# EAGLE design prototipo_2_0 (EAGLE 6.1)
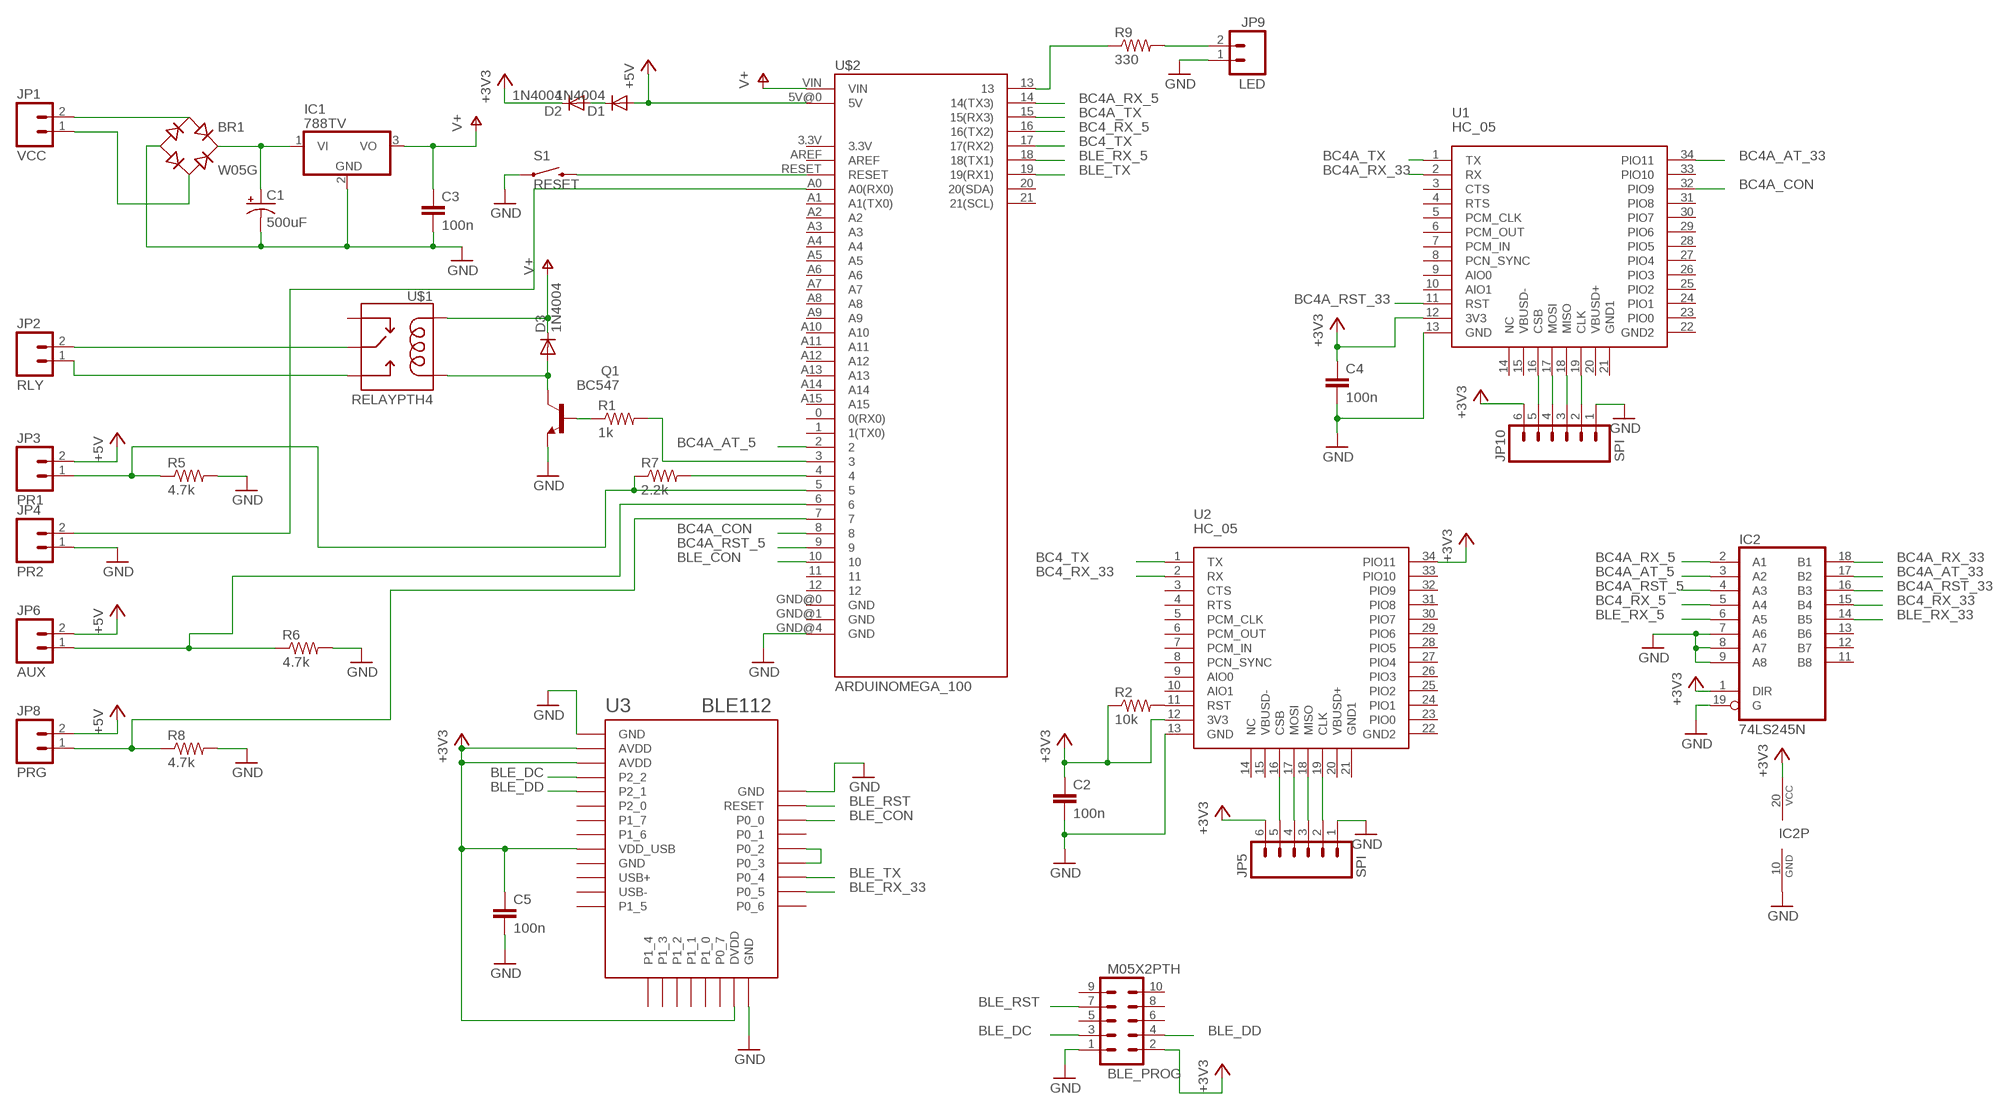
[diagram p0: schematic, sheet 1]

## Parts
BLE_PROG  M05X2PTH  [AVR_ICSP]
BR1  W05G  [WOG]
C1  500uF  CAP_POLPTH4  [CPOL-RADIAL-1000UF-25V]
C2  100n  C5/3  [C5B3]
C3  100n  C5/3  [C5B3]
C4  100n  C5/3  [C5B3]
C5  100n  C5/3  [C5B3]
D1  1N4004  [DO41-10]
D2  1N4004  [DO41-10]
D3  1N4004  [DO41-10]
IC1  788TV  [TO220V]
IC2  74LS245N  [DIL20]
JP1  VCC  M023.5MM  [SCREWTERMINAL-3.5MM-2]
JP2  RLY  M023.5MM  [SCREWTERMINAL-3.5MM-2]
JP3  PR1  M023.5MM  [SCREWTERMINAL-3.5MM-2]
JP4  PR2  M023.5MM  [SCREWTERMINAL-3.5MM-2]
JP5  SPI  M06SIP  [1X06]
JP6  AUX  M023.5MM  [SCREWTERMINAL-3.5MM-2]
JP8  PRG  M023.5MM  [SCREWTERMINAL-3.5MM-2]
JP9  LED  M023.5MM  [SCREWTERMINAL-3.5MM-2]
JP10  SPI  M06SIP  [1X06]
Q1  BC547  [TO92]
R1  1k  RESISTORPTH-1/4W  [AXIAL-0.4]
R2  10k  RESISTORPTH-1/4W  [AXIAL-0.4]
R5  4.7k  RESISTORPTH-1/4W  [AXIAL-0.4]
R6  4.7k  RESISTORPTH-1/4W  [AXIAL-0.4]
R7  2.2k  RESISTORPTH-1/4W  [AXIAL-0.4]
R8  4.7k  RESISTORPTH-1/4W  [AXIAL-0.4]
R9  330  RESISTORPTH-1/4W  [AXIAL-0.4]
S1  RESET  SWITCH-MOMENTARY-2SMD  [TACTILE_SWITCH_SMD]
U1  HC_05  [BLUETOOTH_SMD]
U2  HC_05  [BLUETOOTH_SMD]
U3  BLE112  BLE112-A-VISUAL  [BLE112-A]
U$1  RELAYPTH4  [RELAY-JZC]
U$2  ARDUINOMEGA_100  [ARDUINOMEGA_100]

## Nets
+3V3: BLE_PROG.2 C2.1 C4.1 C5.1 D2.C IC2.1(DIR) IC2.20(VCC) JP5.6 JP10.6 R2.P$1 U1.12(3V3) U2.12(3V3) U2.34(PIO11) U3.AVDD1(AVDD) U3.AVDD2(AVDD) U3.DVDD U3.VDD_USB
+5V: D1.A JP3.2 JP6.2 JP8.2 U$2.5V@0(5V)
BC4_RX_5: IC2.5(A4) U$2.16(16(TX2))
BC4_RX_33: IC2.15(B4) U2.2(RX)
BC4_TX: U2.1(TX) U$2.17(17(RX2))
BC4A_AT_5: IC2.3(A2) U$2.2
BC4A_AT_33: IC2.17(B2) U1.34(PIO11)
BC4A_CON: U1.32(PIO9) U$2.8
BC4A_RST_5: IC2.4(A3) U$2.9
BC4A_RST_33: IC2.16(B3) U1.11(RST)
BC4A_RX_5: IC2.2(A1) U$2.14(14(TX3))
BC4A_RX_33: IC2.18(B1) U1.2(RX)
BC4A_TX: U1.1(TX) U$2.15(15(RX3))
BLE_CON: U3.P0_0 U$2.10
BLE_DC: BLE_PROG.3 U3.P2_2
BLE_DD: BLE_PROG.4 U3.P2_1
BLE_RST: BLE_PROG.7 U3.RESET
BLE_RX_5: IC2.6(A5) U$2.18(18(TX1))
BLE_RX_33: IC2.14(B5) U3.P0_5
BLE_TX: U3.P0_4 U$2.19(19(RX1))
GND [power]: BLE_PROG.1 BR1.- C1.2(-) C2.2 C3.2 C4.2 C5.2 IC1.2(GND) IC2.7(A6) IC2.8(A7) IC2.9(A8) IC2.10(GND) IC2.19(G) JP4.1 JP5.1 JP9.1 JP10.1 Q1.1(E) R5.P$2 R6.P$2 R8.P$2 S1.1 U1.13(GND) U2.13(GND) U3.GND1(GND) U3.GND3(GND) U3.GND4(GND) U$2.GND@4(GND)
N$1: R2.P$2 U2.11(RST)
N$2: D1.C D2.A
N$3 [power]: BR1.+ C1.1(+) IC1.1(VI)
N$4: R1.P$2 U$2.3
N$5: Q1.2(B) R1.P$1
N$6 [power]: D3.A Q1.3(C) U$1.1(COIL2)
N$7 [relay]: JP2.1 U$1.3(NO)
N$8 [relay]: JP2.2 U$1.4(MAIN)
N$9: S1.3 U$2.RESET
N$10: U3.P0_2 U3.P0_3
N$11: JP5.2 U2.19(CLK)
N$12: JP5.3 U2.18(MISO)
N$13: JP5.4 U2.17(MOSI)
N$14: JP5.5 U2.16(CSB)
N$17: JP10.5 U1.16(CSB)
N$18: JP3.1 R5.P$1 R7.P$1 U$2.5
N$19: JP6.1 R6.P$1 U$2.6
N$20: R7.P$2 U$2.4
N$21: JP8.1 R8.P$1 U$2.7
N$22: JP10.4 U1.17(MOSI)
N$23: R9.P$1 U$2.13
N$24: JP9.2 R9.P$2
N$28: JP10.3 U1.18(MISO)
N$29: JP10.2 U1.19(CLK)
N$30: JP4.2 U$2.A0(A0(RX0))
V+ [power]: C3.1 D3.C IC1.3(VO) U$1.5(COIL1) U$2.VIN
VCC1 [power]: BR1.AC1 JP1.2
VCC2 [power]: BR1.AC2 JP1.1
Unconnected: BLE_PROG.5 BLE_PROG.6 BLE_PROG.8 BLE_PROG.9 BLE_PROG.10 IC2.11(B8) IC2.12(B7) IC2.13(B6) U1.3(CTS) U1.4(RTS) U1.5(PCM_CLK) U1.6(PCM_OUT) U1.7(PCM_IN) U1.8(PCN_SYNC) U1.9(AIO0) U1.10(AIO1) U1.14(NC) U1.15(VBUSD-) U1.20(VBUSD+) U1.21(GND1) U1.22(GND2) U1.23(PIO0) U1.24(PIO1) U1.25(PIO2) U1.26(PIO3) U1.27(PIO4) U1.28(PIO5) U1.29(PIO6) U1.30(PIO7) U1.31(PIO8) U1.33(PIO10) U2.3(CTS) U2.4(RTS) U2.5(PCM_CLK) U2.6(PCM_OUT) U2.7(PCM_IN) U2.8(PCN_SYNC) U2.9(AIO0) U2.10(AIO1) U2.14(NC) U2.15(VBUSD-) U2.20(VBUSD+) U2.21(GND1) U2.22(GND2) U2.23(PIO0) U2.24(PIO1) U2.25(PIO2) U2.26(PIO3) U2.27(PIO4) U2.28(PIO5) U2.29(PIO6) U2.30(PIO7) U2.31(PIO8) U2.32(PIO9) U2.33(PIO10) U3.P0_1 U3.P0_6 U3.P0_7 U3.P1_0 U3.P1_1 U3.P1_2 U3.P1_3 U3.P1_4 U3.P1_5 U3.P1_6 U3.P1_7 U3.P2_0 U3.USB+ U3.USB- U$1.2(NC) U$2.0(0(RX0)) U$2.1(1(TX0)) U$2.3.3V U$2.11 U$2.12 U$2.20(20(SDA)) U$2.21(21(SCL)) U$2.A1(A1(TX0)) U$2.A2 U$2.A3 U$2.A4 U$2.A5 U$2.A6 U$2.A7 U$2.A8 U$2.A9 U$2.A10 U$2.A11 U$2.A12 U$2.A13 U$2.A14 U$2.A15 U$2.AREF U$2.GND@0(GND) U$2.GND@1(GND)

## Power pins joined to a net without a drawn wire
GND: U3.GND2(GND)

## Library data of the parts
BLE_PROG = SparkFun-Connectors:M05X2: Header 5x2 Standard 10-pin dual row 0.1" header. Commonly used with AVR-ISP. Use with Spark Fun Electronics SKU: PRT-00778
BR1 = dbridge:W*G: Vishay/General Semiconductor W005G - W10G Bridge rectifier, 1.5A, 50 to 1000V
C1 = SparkFun-Passives:CAP_POL: Capacitor Polarized These are standard SMD and PTH capacitors. Normally 10uF, 47uF, and 100uF in electrolytic and tantalum varieties. Always verify the external diameter of the through hole cap, it varies with capacity, voltage, and manufacturer. The EIA devices should be standard.
C2-C5 = capacitor-wima:C: CAPACITOR naming: grid - package width
D1-D3 = diode:1N4004: DIODE general purpose rectifier, 1 A
IC1 = linear:78*: Positive VOLTAGE REGULATOR Source: http://cache.national.com/ds/LM/LM78L05.pdf http://www.fairchildsemi.com/ds/LM/LM7805.pdf
IC2 = adafruit:74*245: Octal BUS TRANSCEIVER, 3-state
JP1-JP4 JP6 JP8 JP9 = SparkFun-Connectors:M02: Header 2 Standard 2-pin 0.1" header. Use with straight break away headers (SKU : PRT-00116), right angle break away headers (PRT-00553), swiss pins (PRT-00743), machine pins (PRT-00117), and female headers (PRT-00115). Molex polarized connector foot print use with SKU : PRT-08233 with associated crimp pins and housings.
JP5 JP10 = SparkFun-Connectors:M06: Header 6 Standard 6-pin 0.1" header. Use with straight break away headers (SKU : PRT-00116), right angle break away headers (PRT-00553), swiss pins (PRT-00743), machine pins (PRT-00117), and female headers (PRT-00115). Molex polarized connector foot print use with SKU : PRT-08094 with associated crimp pins and housings. NOTES ON THE VARIANTS LOCK and LOCK_LONGPADS... This footprint was designed to help hold the alignment of a through-hole component (i.e. 6-pin header) while soldering it into place. You may notice that each hole has been shifted either up or down by 0.005 of an inch from it's more standard position (which is a perfectly straight line). This slight alteration caused the pins (the squares in the middle) to touch the edges of the holes. Because they are alternating, it causes a "brace" to hold the component in place. 0.005 has proven to be the perfect amount of "off-center" position when using our standard breakaway headers. Although looks a little odd when you look at the bare footprint, once you have a header in there, the alteration is very hard to notice. Also, if you push a header all the way into place, it is covered up entirely on the bottom side. This idea of altering the position of holes to aid alignment will be further integrated into the Sparkfun Library for other footprints. It can help hold any component with 3 or more connection pins.
Q1 = transistor-npn:BC547*: NPN Transistor
R1 R2 R5-R9 = SparkFun-Passives:RESISTOR: Resistor Basic schematic elements and footprints for 0603, 1206, and PTH resistors.
S1 = SparkFun-Electromechanical:SWITCH-MOMENTARY-2: Various NO switches- pushbuttons, reed, etc
U1 U2 = SerialPortBluetooth:HC_05
U3 = sf-bluegiga:BLE112-A-VISUAL: Bluetooth Low Energy single-mode module - Bluetooth 4.0, chip antenna
U$1 = SparkFun-Electromechanical:RELAY: SPDT relay (COM-00101)
U$2 = prymia:ARDUINOMEGA_100

## Net classes
1 power: width 0.762 mm, drill 0.762 mm, clearance 0.635 mm
2 relay: width 1.27 mm, drill 1.27 mm, clearance 0.635 mm

## Board
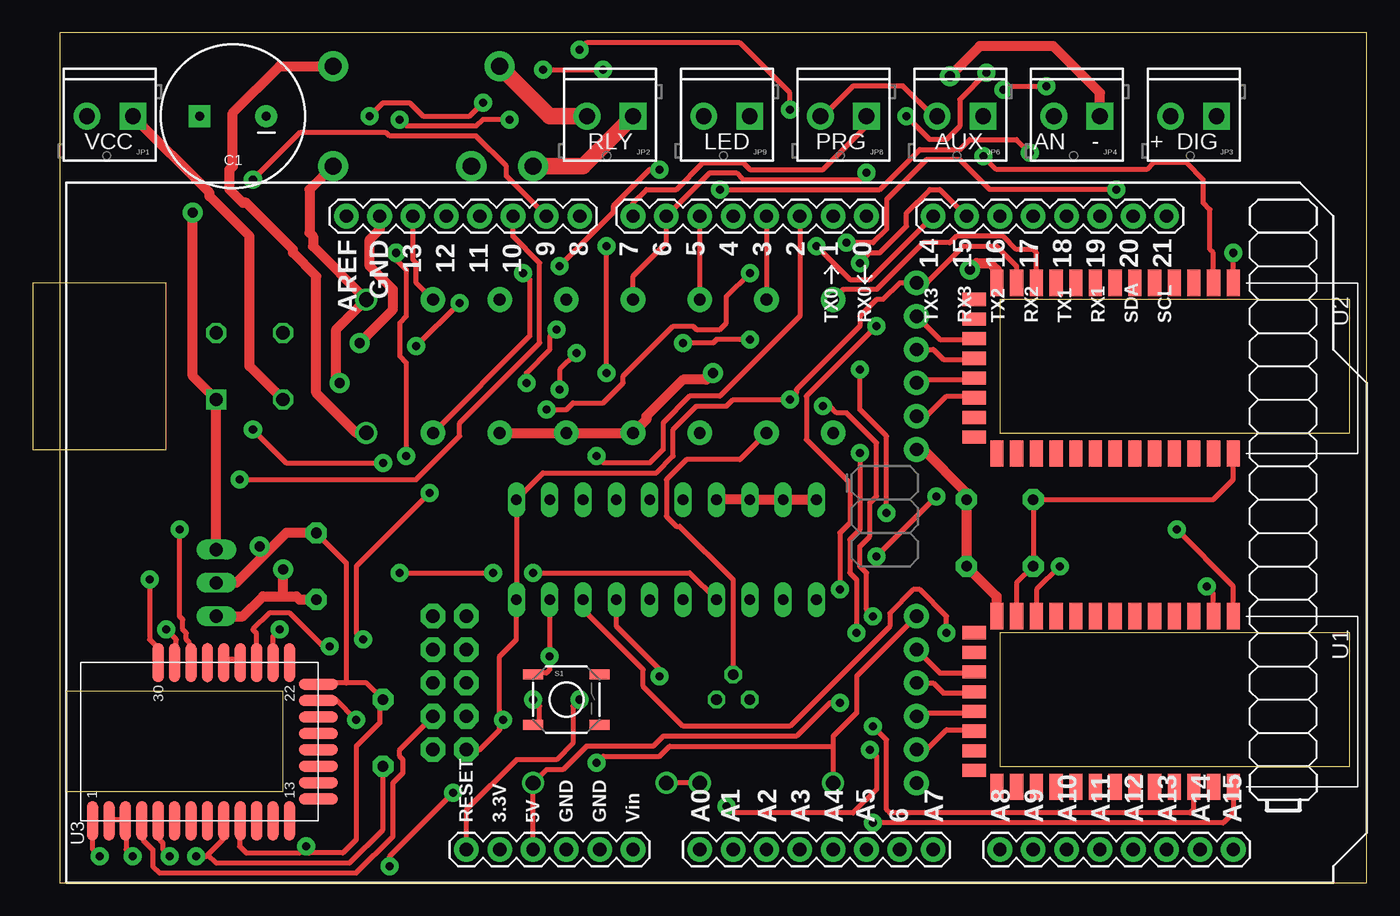
[diagram p1: board, top side]
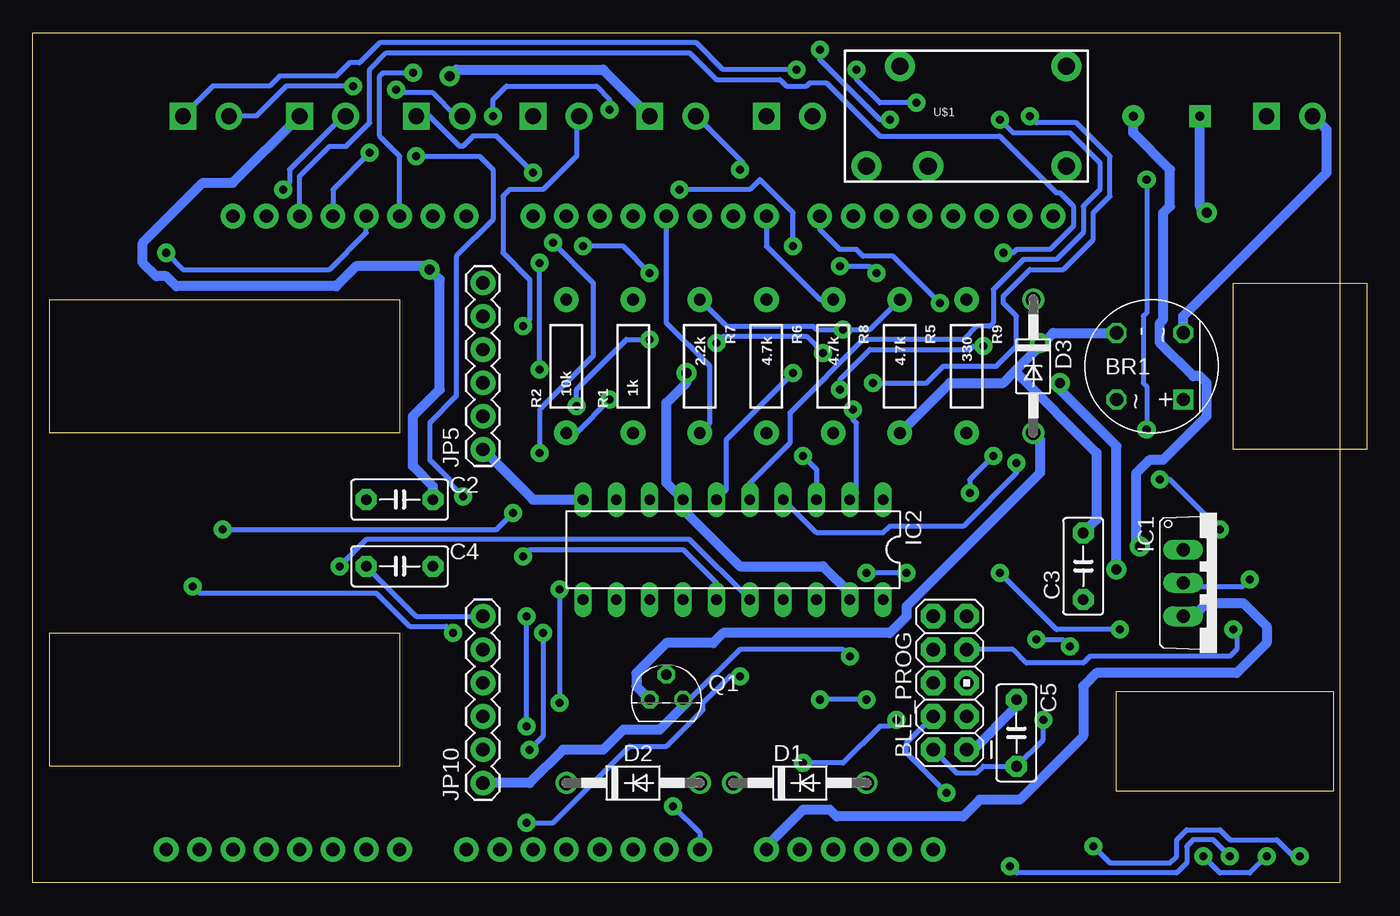
[diagram p2: board, bottom side, seen from below]

Size 101.6 x 64.77 mm. Coordinates in mm from the lower left corner, seen from the top.
Outline: 2.03,0 101.6,0 101.6,64.77 2.03,64.77 2.03,0
Copper layers (1*16): Top 0.035mm / dielectric 1.5mm / Bottom 0.035mm
Design rules: minimum track width 15mil, minimum drill 24mil, track to track 15mil, track to pad 15mil, pad to pad 15mil, via to via 15mil, smd to smd 15mil, copper to edge 20mil, drill to drill 8mil, minimum pad ring 10mil, minimum via ring 15mil, stop-mask expansion 4mil, vias tented up to drill 0mil, thermal gap 10mil

### Footprints (pad centres in the part's own frame; a part is rotated, then mirrored left to right if it is on the bottom)
AVR_ICSP = drill 1.016 pad 1.88 octagon: 1 -1.27,5.08; 2 1.27,5.08; 3 -1.27,2.54; 4 1.27,2.54; 5 -1.27,0; 6 1.27,0; 7 -1.27,-2.54; 8 1.27,-2.54; 9 -1.27,-5.08; 10 1.27,-5.08
WOG = drill 1.016 square: + 2.54,2.54 | drill 1.016 octagon: - -2.54,-2.54; AC1 -2.54,2.54; AC2 2.54,-2.54
CPOL-RADIAL-1000UF-25V = drill 0.7 pad 1.651 square: 1 2.54,0 | drill 0.7 pad 1.651: 2 -2.54,0
C5B3 = drill 0.813 pad 1.6 octagon: 1 -2.54,0; 2 2.54,0
DO41-10 = drill 1.118: A 5.08,0; C -5.08,0
TO220V = drill 1.016 long: 1 -2.54,-2.54; 2 0,-2.54; 3 2.54,-2.54
DIL20 = drill 0.813 long: 1 -11.43,-3.81; 2 -8.89,-3.81; 3 -6.35,-3.81; 4 -3.81,-3.81; 5 -1.27,-3.81; 6 1.27,-3.81; 7 3.81,-3.81; 8 6.35,-3.81; 9 8.89,-3.81; 10 11.43,-3.81; 11 11.43,3.81; 12 8.89,3.81; 13 6.35,3.81; 14 3.81,3.81; 15 1.27,3.81; 16 -1.27,3.81; 17 -3.81,3.81; 18 -6.35,3.81; 19 -8.89,3.81; 20 -11.43,3.81
SCREWTERMINAL-3.5MM-2 = drill 1.2 pad 2.032 square: 1 0,0 | drill 1.2 pad 2.032: 2 3.5,0
1X06 = drill 1.016 pad 1.88: 1 0,0; 2 2.54,0; 3 5.08,0; 4 7.62,0; 5 10.16,0; 6 12.7,0
TO92 = drill 0.813 octagon: 1 1.27,0; 2 0,1.905; 3 -1.27,0
AXIAL-0.4 = drill 0.9 pad 1.88: P$1 -5.08,0; P$2 5.08,0
TACTILE_SWITCH_SMD = smd 1.524 x 0.762: 1 -2.54,1.905; 2 2.54,1.905; 3 -2.54,-1.905; 4 2.54,-1.905
BLUETOOTH_SMD = smd 2 x 1: 1 0,0; 2 0,-1.5; 3 0,-3; 4 0,-4.5; 5 0,-6; 6 0,-7.5; 7 0,-9; 8 0,-10.5; 9 0,-12; 10 0,-13.5; 11 0,-15; 12 0,-16.5; 13 0,-18; 22 13,-18; 23 13,-16.5; 24 13,-15; 25 13,-13.5; 26 13,-12; 27 13,-10.5; 28 13,-9; 29 13,-7.5; 30 13,-6; 31 13,-4.5; 32 13,-3; 33 13,-1.5; 34 13,0 | smd 1 x 1.8: 14 1.25,-19.75; 15 2.75,-19.75; 16 4.25,-19.75; 17 5.75,-19.75; 18 7.25,-19.75; 19 8.75,-19.75; 20 10.25,-19.75; 21 11.75,-19.75
BLE112-A = smd 3 x 0.85: AVDD1 -6.05,6.9; AVDD2 -6.05,5.65; GND1 -6.05,8.15; GND2 -6.05,-3.1; GND4 6,3.15; P0_0 6,0.65; P0_1 6,-0.6; P0_2 6,-1.85; P0_3 6,-3.1; P0_4 6,-4.35; P0_5 6,-5.6; P0_6 6,-6.85; P1_5 -6.05,-6.85; P1_6 -6.05,-0.6; P1_7 -6.05,0.65; P2_0 -6.05,1.9; P2_1 -6.05,3.15; P2_2 -6.05,4.4; RESET 6,1.9; USB+ -6.05,-4.35; USB- -6.05,-5.6; VDD_USB -6.05,-1.85 | smd 0.85 x 3: DVDD 3.1,-9.05; GND3 4.35,-9.05; P0_7 1.85,-9.05; P1_0 0.6,-9.05; P1_1 -0.65,-9.05; P1_2 -1.9,-9.05; P1_3 -3.15,-9.05; P1_4 -4.4,-9.05
RELAY-JZC = drill 1.3 pad 2.286: 1 3.81,-8.89; 2 -3.81,1.651; 3 -3.81,6.35; 4 3.81,3.81; 5 -3.81,-8.89
ARDUINOMEGA_100 = drill 1.016 pad 1.88: 0 60.96,50.8; 1 58.42,50.8; 2 55.88,50.8; 3 53.34,50.8; 3.3V 33.02,2.54; 4 50.8,50.8; 5 48.26,50.8; 5V@0 35.56,2.54; 6 45.72,50.8; 7 43.18,50.8; 8 39.116,50.8; 9 36.576,50.8; 10 34.036,50.8; 11 31.496,50.8; 12 28.956,50.8; 13 26.416,50.8; 14 66.04,50.8; 15 68.58,50.8; 16 71.12,50.8; 17 73.66,50.8; 18 76.2,50.8; 19 78.74,50.8; 20 81.28,50.8; 21 83.82,50.8; A0 48.26,2.54; A1 50.8,2.54; A2 53.34,2.54; A3 55.88,2.54; A4 58.42,2.54; A5 60.96,2.54; A6 63.5,2.54; A7 66.04,2.54; A8 71.12,2.54; A9 73.66,2.54; A10 76.2,2.54; A11 78.74,2.54; A12 81.28,2.54; A13 83.82,2.54; A14 86.36,2.54; A15 88.9,2.54; AREF 21.336,50.8; GND@0 38.1,2.54; GND@1 40.64,2.54; GND@4 23.876,50.8; RESET 30.48,2.54; VIN 43.18,2.54

### Placement (x,y rotation side)
BLE_PROG  31.75,15.24 180 bottom
BR1  16.51,39.37 270 bottom
C1  15.24,58.42 180 top
C2  73.66,29.21 0 bottom
C3  21.59,24.13 90 bottom
C4  73.66,24.13 0 bottom
C5  26.67,11.43 90 bottom
D1  43.18,7.62 0 bottom
D2  55.88,7.62 0 bottom
D3  25.4,39.37 270 bottom
IC1  11.43,22.86 270 bottom
IC2  48.26,25.4 180 bottom
JP1  7.62,58.42 180 top
JP2  45.72,58.42 180 top
JP3  90.17,58.42 180 top
JP4  81.28,58.42 180 top
JP5  67.31,33.02 90 bottom
JP6  72.39,58.42 180 top
JP8  63.5,58.42 180 top
JP9  54.61,58.42 180 top
JP10  67.31,7.62 90 bottom
Q1  53.34,13.97 0 bottom
R1  55.88,39.37 90 bottom
R2  60.96,39.37 90 bottom
R5  35.56,39.37 270 bottom
R6  45.72,39.37 270 bottom
R7  50.8,39.37 270 bottom
R8  40.64,39.37 270 bottom
R9  30.48,39.37 270 bottom
S1  40.64,13.97 0 top
U1  91.44,20.32 270 top
U2  91.44,45.72 270 top
U3  12.7,10.79 90 top
U$1  31.75,58.42 90 bottom
U$2  2.54,0 0 top

### Tracks (layer width: path | path; a pad name or v marks a point on that pad's centre or on a via)
+3V3  (via drill 0.61)
  Top 0.381: 60.96,10.41 60.96,11.18 62.74,12.95 62.74,15.75 JP10.6 | 60.96,10.41 D2.C | U1.12 74.93,22.86 C4.1 C2.1 89.92,29.21 91.44,30.73 U2.34 | U2.12 74.93,46.99 73.41,48.51 70.87,48.51 68.07,45.72 JP5.6 66.04,45.72 64.77,44.45 64.26,44.45 62.99,43.18 62.99,42.42 58.17,37.59 58.17,37.34 v57.66,36.83 53.34,36.83 52.83,36.32 50.55,36.32 48.77,34.54 48.77,32.51 47.5,31.24 38.86,31.24 IC2.1 IC2.20 36.83,18.54 35.56,17.27 35.56,12.45 | U3.AVDD1 5.84,4.83 6.86,4.83 U3.AVDD2 7.11,4.57 7.11,2.54 v7.62,2.03 | 35.56,12.45 35.56,11.68 34.04,10.16 BLE_PROG.2 | 60.96,10.41 48.51,10.41 47.75,9.65 43.43,9.65 v42.93,9.14 | 35.56,12.45 v35.81,12.45 | v24.64,12.45 23.11,13.97 21.84,13.97 U3.DVDD | 13.34,2.16 13.21,2.03 v12.45,2.03 | 13.34,2.16 14.48,3.3 14.48,4.57 U3.VDD_USB | C5.1 26.67,4.06 24.13,1.52 13.97,1.52 13.34,2.16
  Bottom 0.381: JP10.6 72.39,20.32 C4.1 | R2.P$1 60.2,34.29 v57.66,36.83 | BLE_PROG.2 31.24,8.38 29.72,8.38 29.21,8.89 C5.1 24.64,10.92 v24.64,12.45 | v42.93,9.14 39.88,9.14 37.08,11.94 36.32,11.94 v35.81,12.45 | v12.45,2.03 11.18,0.76 8.89,0.76 v7.62,2.03
+5V  (via drill 0.61)
  Top 0.381: U$2.5V@0 D1.A 39.12,8.64 40.39,8.64 42.16,10.41 47.24,10.41 48.01,11.18 58.17,11.18 60.71,13.72 v61.47,13.72 | JP6.2 68.58,58.42 66.29,60.71 62.48,60.71 60.2,58.42 JP8.2 | v77.22,60.71 74.17,60.71 v73.91,60.45 | v61.47,22.35 61.47,26.67 62.23,27.43 62.23,30.48 58.93,33.78 58.93,37.08 v64.26,42.42
  Bottom 0.381: JP3.2 84.58,58.42 82.3,60.71 v77.22,60.71 | v73.91,60.45 73.66,60.2 71.12,60.2 69.34,58.42 JP6.2 | v61.47,22.35 v61.47,13.72 | v64.26,42.42 63.75,42.93 63.75,45.97 65.79,48.01 65.79,52.32 65.28,52.83 62.74,52.83 60.2,55.37 60.2,58.42 JP8.2
BC4_RX_5  (via drill 0.61)
  Top 0.381: v27.94,58.17 28.45,57.66 33.78,57.66 34.29,58.17 v36.32,58.17 | v41.66,63.5 42.16,64.01 53.85,64.01 57.66,60.2 v57.66,58.93 | v66.55,58.42 68.33,56.64 69.6,56.64 70.61,57.66 70.61,59.69 v72.64,61.72
  Bottom 0.381: IC2.5 46.99,30.48 43.94,33.53 43.94,35.81 38.35,41.4 30.73,41.4 29.72,42.42 28.7,42.42 28.45,42.67 28.45,45.21 26.16,47.5 23.62,47.5 21.59,49.53 21.59,51.56 20.32,52.83 20.32,54.86 22.61,57.15 26.92,57.15 v27.94,58.17 | v36.32,58.17 37.08,58.17 41.66,62.74 v41.66,63.5 | v57.66,58.93 57.66,59.69 58.67,60.71 65.53,60.71 66.55,59.69 v66.55,58.42 | v72.64,61.72 74.93,61.72 75.18,61.47 75.18,56.9 73.66,55.37 U$2.16
BC4_RX_33  (via drill 0.61)
  Top 0.381: v68.83,29.46 v64.26,24.89 | v72.39,55.37 73.41,54.36 84.84,54.36 85.34,54.86 87.88,54.86 89.15,53.59 89.15,51.82 89.66,51.31 89.66,48.26 89.92,48.01 89.92,45.72 U2.2
  Bottom 0.381: IC2.15 49.53,22.86 52.07,25.4 63.75,25.4 v64.26,24.89 | v68.83,29.46 69.85,30.48 69.85,30.73 71.37,32.26 71.37,35.05 69.34,37.08 69.34,47.75 66.55,50.55 66.55,54.36 67.56,55.37 v72.39,55.37
BC4_TX  (via drill 0.61)
  Top 0.381: U2.1 v91.44,48.01
  Bottom 0.381: U$2.17 76.2,49.53 78.99,46.74 90.17,46.74 v91.44,48.01
BC4A_AT_5  (via drill 0.61)
  Top 0.381: v42.93,32.51 43.43,32 46.99,32 48.01,33.02 48.01,35.05 50.04,37.08 52.32,37.08 58.42,43.18 U$2.2
  Bottom 0.381: IC2.3 41.91,31.5 v42.93,32.51
BC4A_AT_33  (via drill 0.61)
  Top 0.381: IC2.17 44.45,19.56 47.75,16.26 v47.75,15.75 | v64.01,4.57 90.68,4.57 91.44,5.33 U1.34
  Bottom 0.381: v47.75,15.75 48.51,15.75 50.55,13.72 50.55,13.21 53.34,10.41 56.13,10.41 61.98,4.57 v64.01,4.57
BC4A_CON  (via drill 0.61)
  Top 0.381: v29.21,40.89 v32.51,44.2 | v40.13,37.59 40.13,39.12 v41.4,40.39 | v49.53,41.15 51.82,41.15 52.07,41.4 v54.61,41.4 | v60.2,36.32 60.71,36.32 61.21,35.81 61.98,35.81 64.26,33.53 64.26,29.46 63.75,28.96 63.75,26.42 62.99,25.65 62.99,24.13 63.5,23.62 63.5,20.83 v64.01,20.32 | v64.01,11.94 65.02,10.92 65.02,5.59 65.28,5.33 88.14,5.33 88.39,5.59 88.39,7.11 U1.32
  Bottom 0.381: U$2.8 41.66,49.78 40.13,48.26 38.86,48.26 38.35,47.75 36.07,47.75 v32.51,44.2 | v29.21,40.89 29.97,40.89 30.23,40.64 37.85,40.64 40.13,38.35 v40.13,37.59 | v41.4,40.39 42.67,41.66 49.02,41.66 v49.53,41.15 | v54.61,41.4 56.39,41.4 60.2,37.59 v60.2,36.32 | v64.01,11.94 v64.01,20.32
BC4A_RST_5  (via drill 0.61)
  Top 0.381: v26.67,32 19.3,32 v16.76,34.54 | v16.76,53.59 20.32,57.15 26.92,57.15 27.18,56.9 33.78,56.9 36.07,54.61 36.07,53.85 U$2.9
  Bottom 0.381: IC2.4 41.91,26.67 36.83,26.67 36.32,27.18 30.73,27.18 26.67,31.24 v26.67,32 | v16.76,34.54 16.76,37.85 17.02,38.1 17.02,43.18 16.76,43.43 v16.76,53.59
BC4A_RST_33  (via drill 0.61)
  Top 0.381: v78.23,24.13 76.45,22.35 76.45,20.32 U1.11
  Bottom 0.381: v78.23,24.13 76.2,26.16 51.56,26.16 IC2.16
BC4A_RX_5  (via drill 0.61)
  Top 0.381: U$2.14 63.75,45.97 62.23,45.97 v59.69,48.51 | v54.61,46.48 52.83,44.7 52.83,42.67 52.32,42.16 50.55,42.16 50.29,42.42 48.77,42.42 44.96,38.61 44.96,38.1 43.43,36.58 41.15,36.58 40.64,36.07 v39.12,36.07
  Bottom 0.381: v59.69,48.51 56.64,48.51 v54.61,46.48 | v39.12,36.07 39.12,35.31 38.86,35.05 38.86,29.72 IC2.2
BC4A_RX_33  (via drill 0.61)
  Top 0.381: IC2.18 41.91,20.83 46.48,16.26 46.48,14.99 49.53,11.94 57.66,11.94 65.28,19.56 65.28,20.57 67.06,22.35 67.56,22.35 69.6,20.32 v69.6,19.05 | v89.41,22.61 89.92,22.1 89.92,20.32 U1.2
  Bottom 0.381: v69.6,19.05 70.1,19.56 72.9,19.56 75.44,22.1 88.9,22.1 v89.41,22.61
BC4A_TX  (via drill 0.61)
  Top 0.381: U$2.15 69.09,52.83 68.33,52.83 66.55,51.05 66.55,50.04 64.52,48.01 63.75,48.01 v62.99,47.24 | v62.99,39.12 62.99,36.07 65.02,34.04 v65.02,28.19 | v87.12,26.92 91.44,22.61 U1.1
  Bottom 0.381: v62.99,39.12 v62.99,47.24 | v65.02,28.19 66.29,26.92 v87.12,26.92
BLE_CON  (via drill 0.61)
  Top 0.381: U$2.10 36.58,49.28 38.61,47.24 38.61,41.15 32.51,35.05 32.51,34.04 29.21,30.73 v15.75,30.73 | v11.18,26.92 11.18,20.32 11.43,20.07 11.43,19.3 11.68,19.05 11.68,18.54 11.94,18.29 11.94,17.02 U3.P0_0
  Bottom 0.381: v15.75,30.73 14.99,30.73 v11.18,26.92
BLE_DC
  Top 0.381: BLE_PROG.3 27.94,10.16 27.94,9.65 28.19,9.4 28.19,8.38 27.43,7.62 27.43,3.56 24.64,0.76 9.65,0.76 9.14,1.27 9.14,2.54 8.38,3.3 8.38,4.57 U3.P2_2
BLE_DD  (via drill 0.61)
  Top 0.381: v32,6.86 27.18,2.03 v27.18,1.27 | v10.41,2.03 9.91,2.54 9.91,3.05 9.65,3.3 9.65,4.57 U3.P2_1
  Bottom 0.381: BLE_PROG.4 35.05,10.67 35.05,9.91 v32,6.86 | v27.18,1.27 26.67,0.76 14.48,0.76 13.72,1.52 13.72,2.79 13.21,3.3 11.68,3.3 v10.41,2.03
BLE_RST  (via drill 0.61)
  Top 0.381: v10.16,19.3 10.92,18.54 10.92,17.02 U3.RESET
  Bottom 0.381: BLE_PROG.7 26.92,17.78 25.91,16.76 21.59,16.76 21.08,17.27 10.41,17.27 9.91,17.78 9.91,19.05 v10.16,19.3
BLE_RX_5  (via drill 0.61)
  Top 0.381: v75.95,55.63 74.93,56.64 71.37,56.64 70.61,55.88 67.56,55.88 64.52,52.83 v52.32,52.83 | v43.69,38.86 v43.69,48.51
  Bottom 0.381: U$2.18 78.74,52.83 v75.95,55.63 | v52.32,52.83 46.99,52.83 46.23,53.59 43.69,51.05 v43.69,48.51 | v43.69,38.86 48.77,33.78 48.77,29.97 IC2.6
BLE_RX_33  (via drill 0.61)
  Top 0.381: IC2.14 50.04,23.62 v38.1,23.62 | v27.94,23.62 v35.05,23.62 | v18.8,19.3 18.29,18.8 18.29,17.02 U3.P0_5
  Bottom 0.381: v35.05,23.62 v38.1,23.62 | v27.94,23.62 23.62,19.3 v18.8,19.3
BLE_TX  (via drill 0.61)
  Top 0.381: v22.61,18.03 22.1,18.03 19.56,20.57 18.03,20.57 16.76,19.3 17.02,19.05 17.02,17.02 U3.P0_4 | v25.15,18.54 24.64,19.05 24.64,24.13 v30.23,29.72 | v28.45,32.51 28.45,39.62 27.94,40.13 27.94,42.67 28.45,43.18 28.45,46.74 27.69,47.5 v27.69,48.01
  Bottom 0.381: v22.61,18.03 23.11,18.54 v25.15,18.54 | v30.23,29.72 30.23,30.73 v28.45,32.51 | v27.69,48.01 26.92,48.01 26.67,48.26 24.13,48.26 22.35,50.04 22.35,51.56 23.37,52.58 23.62,52.58 27.94,56.9 37.08,56.9 41.15,60.96 42.42,60.96 42.67,60.71 44.2,60.71 44.7,61.21 49.53,61.21 51.56,63.25 74.68,63.25 75.95,61.98 75.95,57.91 77.72,56.13 78.99,56.13 81.28,53.85 U$2.19
GND  (via drill 0.61, 0.76)
  Top 0.381: v5.08,2.03 4.57,2.54 4.57,4.57 U3.GND1 | U3.GND2 15.75,4.57 15.75,2.79 16.26,2.29 20.32,2.29 v20.83,2.79 20.83,2.54 21.08,2.29 23.62,2.29 24.64,3.3 24.64,10.41 26.42,12.19 26.42,13.97 C5.2 25.4,15.24 23.88,15.24 | 23.88,15.24 21.84,15.24 U3.GND3 | IC2.19 v39.37,17.27 39.37,16.26 39.12,16 38.1,16 S1.1 | v8.89,23.11 8.89,18.54 9.65,17.78 9.65,17.02 U3.GND4 | 23.88,15.24 23.88,24.38 C3.2
  Top 0.762: IC1.2 15.49,22.86 17.78,25.15 | 17.78,25.15 19.3,26.67 C3.2 | v17.27,25.65 17.78,25.15 | R5.P$2 R8.P$2 R6.P$2 46.74,35.31 46.74,35.56 49.53,38.35 51.31,38.35 v51.82,38.86 | U$2.GND@4 26.42,49.78 25.65,49.02 25.65,46.99 27.43,45.21 27.43,43.69 v24.89,41.15 | v69.85,61.47 72.14,63.75 77.72,63.75 81.28,60.2 JP4.1 | IC2.7 IC2.8 IC2.9 IC2.10 | U1.13 73.41,20.32 73.41,21.84 C4.2 C2.2 71.12,29.72 67.82,33.02 JP5.1 | v71.37,46.74 71.88,47.24 72.9,47.24 73.41,46.74 73.41,45.72 U2.13
  Bottom 0.381: v5.08,2.03 5.59,2.03 6.86,3.3 10.41,3.3 11.18,4.06 13.72,4.06 14.48,3.3 14.48,2.03 14.99,1.52 19.56,1.52 v20.83,2.79 | v8.89,23.11 9.4,22.61 13.72,22.61 IC1.2 | v39.37,17.27 39.88,17.78 47.75,17.78 51.56,13.97 Q1.1
  Bottom 0.762: C5.2 26.67,13.46 29.97,10.16 BLE_PROG.1 | JP10.1 63.75,7.62 61.21,10.16 58.17,10.16 56.64,11.68 53.85,11.68 51.82,13.72 Q1.1 | C1.2 17.78,57.15 14.99,54.36 14.99,51.56 15.49,51.05 15.49,42.93 15.75,42.67 15.75,41.15 13.21,38.61 12.7,38.61 12.19,38.1 12.19,35.56 15.49,32.26 16.51,32.26 17.53,31.24 17.53,25.91 v17.27,25.65 | BR1.- 23.88,41.91 24.77,41.02 | 26.8,38.99 27.69,38.1 31.75,38.1 R5.P$2 | 26.8,38.99 24.77,41.02 | v24.89,41.15 24.77,41.02 | C3.2 20.57,27.69 20.57,32.77 26.8,38.99 | JP9.1 58.17,61.98 69.34,61.98 v69.85,61.47 | C2.2 71.12,30.23 72.64,31.75 72.64,35.56 70.61,37.59 70.61,45.97 v71.37,46.74 71.63,46.99 76.96,46.99 78.49,45.47 90.68,45.47 91.44,46.23 92.2,46.23 93.22,47.24 93.22,48.77 88.65,53.34 86.36,53.34 JP4.1 | IC2.10 63.5,29.21 JP5.1 | v51.82,38.86 51.82,38.1 53.34,36.58 53.34,30.48 IC2.7 51.82,28.96 51.82,28.19 47.75,24.13 41.4,24.13 39.37,22.1 IC2.19
N$1
  Top 0.381: R2.P$2 61.72,45.21 64.26,45.21 67.82,48.77 69.85,48.77 70.36,49.28 73.91,49.28 74.93,48.26 76.2,48.26 76.45,48.01 76.45,45.72 U2.11
N$2
  Top 0.381: D2.A D1.C
N$3  (via drill 0.76)
  Top 0.762: IC1.1 BR1.+ 12.19,38.61 v12.19,51.05
  Bottom 0.762: C1.1 12.7,51.56 v12.19,51.05
N$4
  Top 0.381: U$2.3 R1.P$2
N$5
  Top 0.381: Q1.2 53.34,23.11 49.28,27.18 49.02,27.18 48.26,27.94 48.26,30.73 49.78,32.26 53.85,32.26 R1.P$1
N$6
  Top 0.762: U$1.1 18.8,62.23 15.24,58.67 15.24,54.61 14.99,54.36 14.99,52.83 16,51.82 16.26,51.82 19.81,48.26 19.81,48.01 21.59,46.23 21.59,37.34 24.64,34.29 D3.A
  Bottom 0.762: Q1.3 55.63,14.99 55.63,16 53.34,18.29 49.78,18.29 49.02,19.05 36.32,19.05 35.05,20.32 35.05,21.08 24.89,31.24 24.89,33.78 D3.A
N$7
  Top 1.27: JP2.1 41.91,54.61 U$1.3
N$8
  Top 1.27: JP2.2 39.37,58.42 U$1.4
N$9  (via drill 0.61)
  Top 0.381: U$2.RESET 33.02,5.59 36.83,9.4 39.88,9.4 41.15,10.67 41.15,13.46 v41.66,13.97 | v38.1,13.97 38.61,13.46 38.61,12.19 38.1,12.19 S1.3
  Bottom 0.381: v38.1,13.97 v41.66,13.97
N$10
  Top 0.381: U3.P0_2 14.73,17.02 15.49,17.02 15.75,17.27 16,17.02 U3.P0_3
N$11
  Top 0.381: JP5.2 68.07,35.56 69.6,37.08 71.63,37.08 U2.19
N$12
  Top 0.381: JP5.3 67.56,38.35 71.63,38.35 U2.18
N$13
  Top 0.381: JP5.4 68.58,40.64 69.34,39.88 71.63,39.88 U2.17
N$14
  Top 0.381: JP5.5 69.09,41.4 71.63,41.4 U2.16
N$17
  Top 0.381: JP10.5 69.09,16 71.63,16 U1.16
N$18  (via drill 0.61)
  Top 0.381: U$2.5 R7.P$1 | v38.86,61.98 v43.43,61.98 | v34.29,59.44 33.27,58.42 29.72,58.42 28.7,59.44 26.67,59.44 v25.65,58.42 | v37.59,38.1 37.59,38.86 39.37,40.64 39.37,41.66 v39.88,42.16
  Bottom 0.381: R5.P$1 37.85,42.16 v39.88,42.16 41.91,42.16 42.16,42.42 48.77,42.42 R7.P$1 | JP3.1 87.88,60.71 83.57,60.71 82.8,61.47 78.49,61.47 77.47,62.48 76.71,62.48 75.18,64.01 51.05,64.01 49.02,61.98 v43.43,61.98 | v38.86,61.98 38.86,61.21 37.08,59.44 v34.29,59.44 | v25.65,58.42 25.15,57.91 22.1,57.91 19.56,55.37 19.56,52.32 20.83,51.05 20.83,49.02 23.11,46.74 25.65,46.74 27.69,44.7 27.69,44.2 26.67,43.18 26.67,40.89 28.19,39.37 32.26,39.37 33.53,38.1 v37.59,38.1
N$19  (via drill 0.61)
  Top 0.381: R6.P$1 45.72,46.23 48.26,48.77 U$2.6 51.56,54.1 53.59,54.1 54.1,53.59 62.99,53.59 v63.5,54.1
  Bottom 0.381: JP6.1 71.37,58.42 69.09,56.13 68.83,56.13 68.07,56.9 66.29,56.9 v63.5,54.1
N$20
  Bottom 0.381: U$2.4 53.34,42.67 50.04,39.37 50.04,35.05 R7.P$2
N$21
  Top 0.381: JP8.1 63.5,57.66 60.2,54.36 54.61,54.36 54.1,54.86 51.05,54.86 49.02,52.83 46.74,52.83 45.72,51.82 U$2.7
  Bottom 0.381: R8.P$1 41.66,44.45 45.72,48.51 U$2.7
N$22
  Top 0.381: JP10.4 68.58,15.24 69.34,14.48 71.63,14.48 U1.17
N$23
  Top 0.381: U$2.13 28.96,47.5 29.21,47.24 29.21,45.72 R9.P$1
N$24  (via drill 0.61)
  Top 0.381: R9.P$2 37.85,41.66 37.85,45.97 v37.34,46.48 | v40.13,46.99 44.2,51.05 44.2,51.56 46.99,54.36 v47.75,54.36
  Bottom 0.381: v37.34,46.48 37.85,46.99 v40.13,46.99 | v47.75,54.36 47.75,54.61 47.5,54.86 51.05,58.42 JP9.2
N$28
  Top 0.381: JP10.3 67.56,12.95 71.63,12.95 U1.18
N$29
  Top 0.381: JP10.2 68.07,10.16 69.6,11.68 71.63,11.68 U1.19
N$30  (via drill 0.61)
  Top 0.381: v52.83,5.84 53.34,5.33 62.48,5.33 64.26,7.11 64.26,9.65 v63.75,10.16 | v62.74,19.05 62.74,23.11 62.23,23.62 62.23,26.16 62.99,26.92 v62.99,32.77 | v61.98,48.77 64.01,48.77 65.02,49.78 65.02,52.07 68.07,55.12 70.61,55.12 72.9,52.83 v82.55,52.83
  Bottom 0.381: U$2.A0 50.8,3.81 v52.83,5.84 | v63.75,10.16 62.74,11.18 v62.74,19.05 | v62.99,32.77 62.99,36.07 58.93,40.13 58.93,45.72 v61.98,48.77 | v82.55,52.83 82.04,53.34 82.04,54.36 77.98,58.42 JP4.2
V+  (via drill 0.76)
  Top 0.762: U$1.5 21.08,52.83 21.08,49.53 21.34,49.28 21.34,48.51 D3.C 23.11,42.16 23.11,38.35 v23.37,38.1 | C3.1 20.32,21.59 20.07,21.84 19.05,21.84 | 19.05,21.84 17.53,21.84 16,20.32 IC1.3 | 19.05,21.84 v19.05,23.88
  Bottom 0.762: U$2.VIN 45.72,2.79 42.93,5.59 40.89,5.59 40.39,5.08 30.73,5.08 29.46,6.35 26.42,6.35 21.59,11.18 21.59,14.99 20.57,16 9.91,16 7.62,18.29 7.62,19.56 9.4,21.34 12.19,21.34 13.21,20.32 IC1.3 | v23.37,38.1 23.37,37.59 19.05,33.27 v19.05,23.88
VCC1
  Bottom 0.762: BR1.AC1 13.97,43.18 3.05,54.1 3.05,57.4 4.06,58.42 JP1.2
VCC2
  Top 0.762: JP1.1 13.46,52.58 13.46,52.32 16.51,49.28 16.51,39.37 BR1.AC2

### Text on the board
tPlace: AN - | + DIG